# Altium schematic sheet Sheet1_ChargeManagementControllers.SchDoc
size A
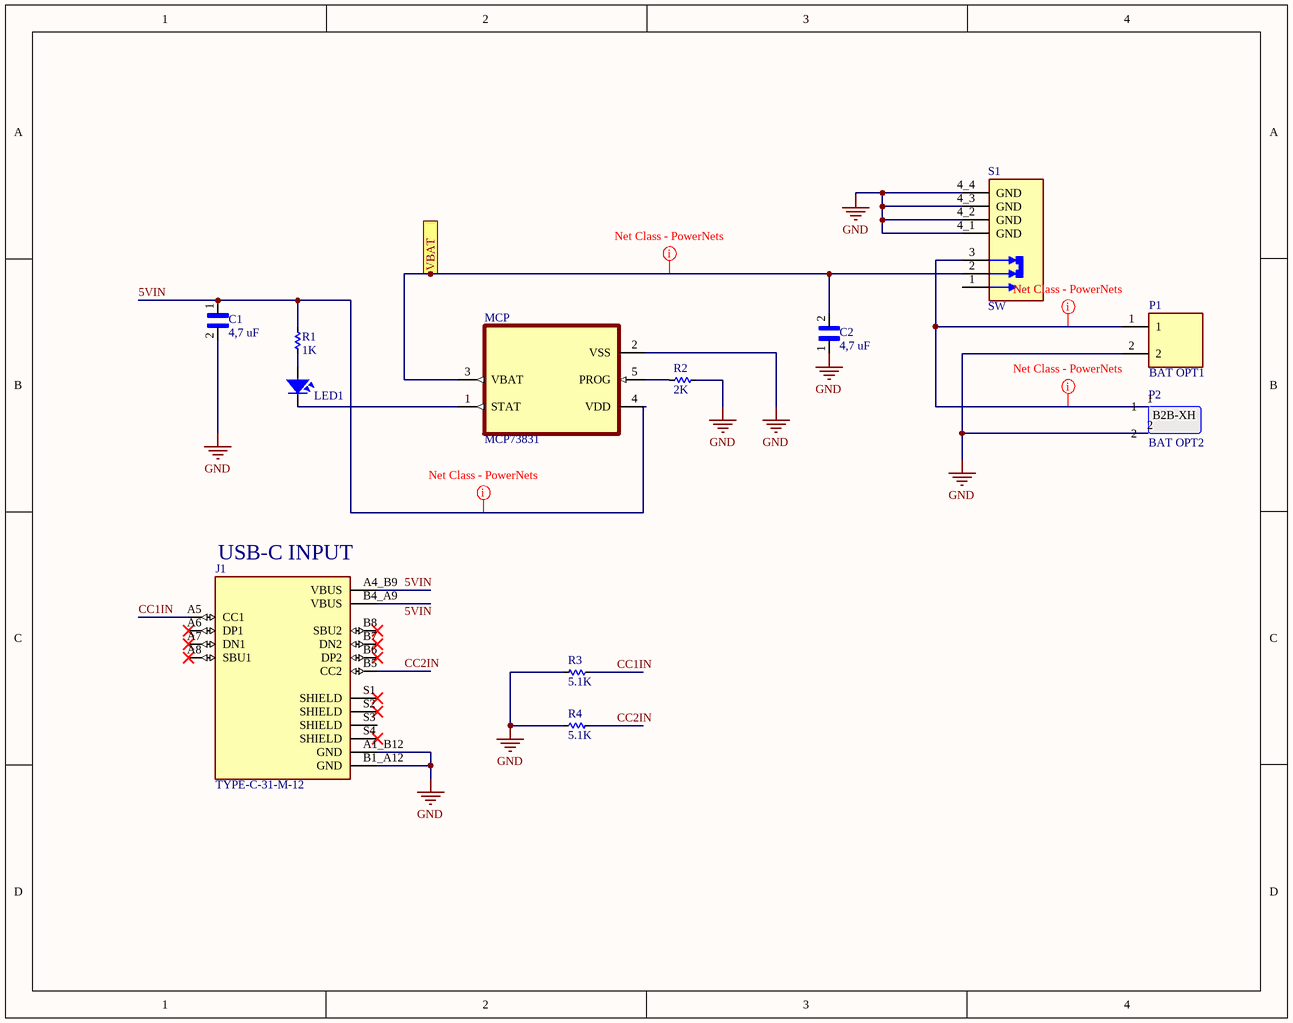
[diagram p0: Sheet1_ChargeManagementControllers.SchDoc]

## Parts
C1  4,7 uF  [CAPC2012X150N]
C2  4,7 uF  [CAPC2012X150N]
J1  TYPE-C-31-M-12  [HRO_TYPE-C-31-M-12]
LED1  LED  [LED-0805-Red]  (value not drawn)
MCP  MCP73831  [SOT95P280X145-5N]
P1  BAT OPT1  [HANDSON_KF301-2P]
P2  BAT OPT2  [JST_B2B-XH-A]
R1  1K  [RES-SMD-0805]
R2  2K  [RES-SMD-0805]
R3  5.1K  [RES-SMD-0805]
R4  5.1K  [RES-SMD-0805]
S1  SW  [SW_MSK12C02]

## Ports
VBAT

## Nets
GND: C1.2 C2.1 J1.A1_B12(GND) J1.B1_A12(GND) MCP.2(VSS) P1.2 P2.2 R2.2 R3.2 R4.2 S1.4_1(GND) S1.4_2(GND) S1.4_3(GND) S1.4_4(GND)
5VIN: C1.1 J1.A4_B9(VBUS) MCP.4(VDD) R1.2
CC1IN: J1.A5(CC1) R3.1
CC2IN: J1.B5(CC2) R4.1
VBAT: C2.2 MCP.3(VBAT) S1.2 ; port VBAT
NetLED1_1: LED1.1 R1.1
NetLED1_2: LED1.2 MCP.1(STAT)
NetMCP_5: MCP.5(PROG) R2.1
NetP1_1: P1.1 P2.1 S1.3

Not connected (* = marked no-connect by the designer): J1 A6(DP1)* A7(DN1)* A8(SBU1)* B4_A9(VBUS) B6(DP2)* B7(DN2)* B8(SBU2)* S1(SHIELD)* S2(SHIELD)* S3(SHIELD) S4(SHIELD)*; S1 1

## Layout directives
net class PowerNets: 5VIN
mark named Net Class - PowerNets: NetP1_1, VBAT

## Notes on the sheet
- (near J1) USB-C INPUT
- Labels drawn without touching a wire or pin: 5VIN
- (in symbol B2B-XH-A) B2B-XH

## Library data of the parts
C1 C2 = C2012X7R1V475M125AE: Cap Ceramic 4.7uF 35V X7R 20% SMD 0805 125C T/R; MP: altium_native_batch; Value: *; Price: None; Availability: Unavailable; Package: None
J1 = TYPE-C-31-M-12: USB Connectors 24 Receptacle 1 8.94*7.3mm RoHS; MF: HRO Electronics Co., Ltd.; SnapEDA_Link: https://www.snapeda.com/parts/TYPE-C-31-M-12/HRO+Electronics+Co.%252C+Ltd./view-part/?ref=snap; Package: Package; Value: *; MP: TYPE-C-31-M-12; Check_prices: https://www.snapeda.com/parts/TYPE-C-31-M-12/HRO+Electronics+Co.%252C+Ltd./view-part/?ref=eda
LED1 = LED SMD: Value: LED 3 - 5 ly 2 Colour
MCP = MCP73831T-2ACI/OT: Charger IC Lithium Ion/Polymer SOT-23-5; MF: Microchip; Package: SOT-23 Microchip; Purchase-URL: https://pricing.snapeda.com/search/part/MCP73831T-2ACI/OT/?ref=eda; MP: MCP73831T-2ACI/OT; Value: *; Availability: In Stock; SnapEDA_Link: https://www.snapeda.com/parts/MCP73831T-2ACI/OT/Microchip/view-part/?ref=snap; Price: None; Check_prices: https://www.snapeda.com/parts/MCP73831T-2ACI/OT/Microchip/view-part/?ref=eda
P1 = KF301-2P: 2 Pin Terminal Block 5mm Pitch; MF: Handson Technology; SnapEDA_Link: https://www.snapeda.com/parts/KF301-2P/Handson+Technology/view-part/?ref=snap; Package: None; Value: *; MP: KF301-2P; Check_prices: https://www.snapeda.com/parts/KF301-2P/Handson+Technology/view-part/?ref=eda
P2 = B2B-XH-A
R1-R4 = Res-SMD: Resistor; Manufacturer: Generic Components; Class: Passive; Published: 08/06/2000; Publisher: Altium Hobart Technology Centre
S1 = MSK12C02: Package: None; Price: None; Value: *; MP: MSK12C02; Availability: Unavailable